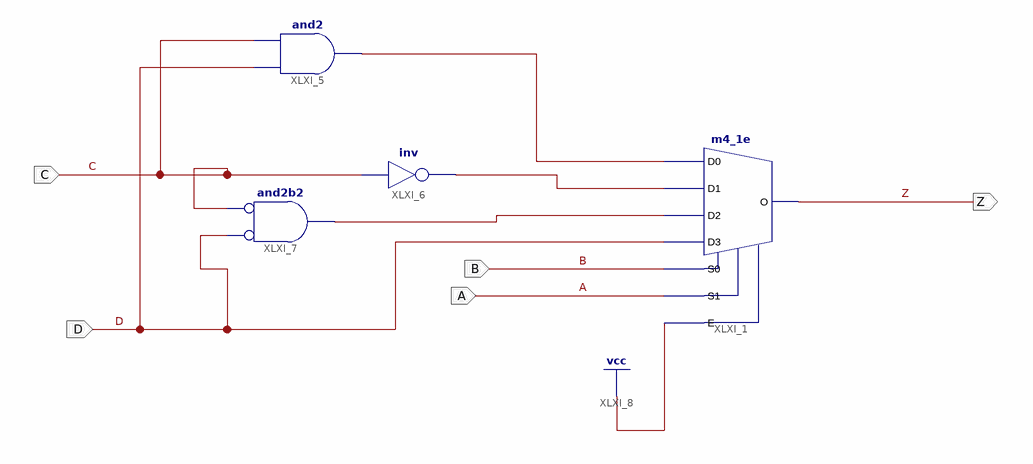
[diagram p0: schematic sheet 1]
// Xilinx ISE schematic p2ej1a.sch (artix7) as structural Verilog: 4 symbols, 5 ports
module p2ej1a (
  input  A,
  input  B,
  input  D,
  input  C,
  output Z
);

  wire XLXN_24, XLXN_25, XLXN_26;

  m4_1e XLXI_1 (.D0(XLXN_24), .D1(XLXN_25), .D2(XLXN_26), .D3(D), .E(1'b1), .S0(B), .S1(A), .O(Z));
  and XLXI_5 (XLXN_24, D, C);
  not XLXI_6 (XLXN_25, C);
  and XLXI_7 (XLXN_26, ~D, ~C);  // and2b2
endmodule
